# EAGLE schematic NE555_ADSR (EAGLE 7.4.0)
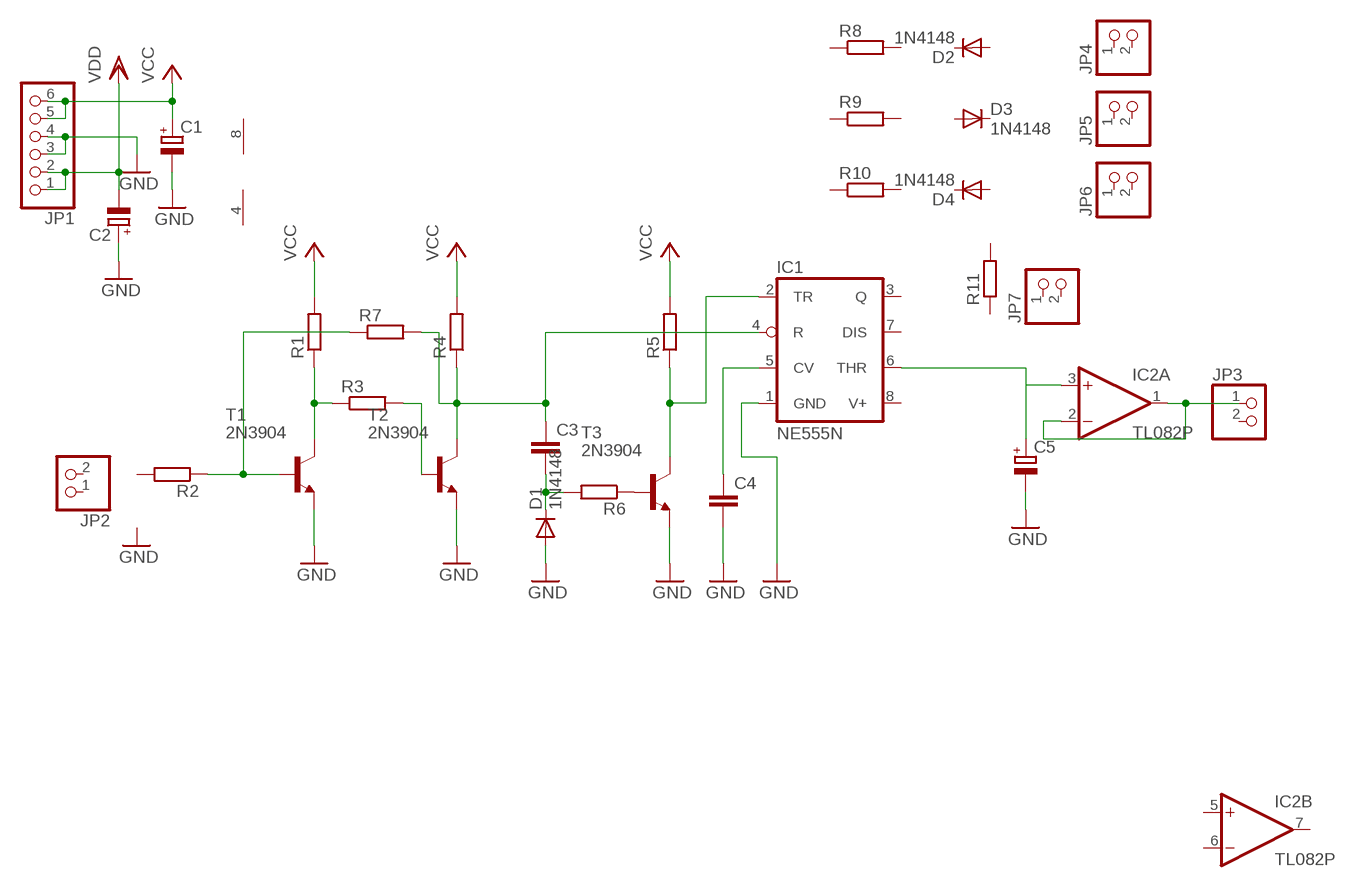
[diagram p0: schematic, sheet 1]

## Parts
C1  CPOL-EUE3.5-8  [E3,5-8]
C2  CPOL-EUE3.5-8  [E3,5-8]
C3  C7.5/3  [C7.5B3]
C4  C7.5/3  [C7.5B3]
C5  CPOL-EUE3.5-8  [E3,5-8]
D1  1N4148  1N4148DO35-7  [DO35-7]
D2  1N4148  1N4148DO35-7  [DO35-7]
D3  1N4148  1N4148DO35-7  [DO35-7]
D4  1N4148  1N4148DO35-7  [DO35-7]
IC1  NE555N  [DIL08-ROUND]
IC2  TL082P  [DIL08]
JP1  PINHD-1X6  [1X06]
JP2  PINHD-1X2  [1X02]
JP3  PINHD-1X2  [1X02]
JP4  PINHD-1X2  [1X02]
JP5  PINHD-1X2  [1X02]
JP6  PINHD-1X2  [1X02]
JP7  PINHD-1X2  [1X02]
R1  R-EU_0207/10  [0207/10]
R2  R-EU_0207/10  [0207/10]
R3  R-EU_0207/10  [0207/10]
R4  R-EU_0207/10  [0207/10]
R5  R-EU_0207/10  [0207/10]
R6  R-EU_0207/10  [0207/10]
R7  R-EU_0207/10  [0207/10]
R8  R-EU_0207/10  [0207/10]
R9  R-EU_0207/10  [0207/10]
R10  R-EU_0207/10  [0207/10]
R11  R-EU_0207/10  [0207/10]
T1  2N3904  [TO92]
T2  2N3904  [TO92]
T3  2N3904  [TO92]

## Nets
GND: C1.- C2.+ C4.2 C5.- D1.A IC1.1(GND) JP1.3 JP1.4 T1.3(E) T2.3(E) T3.3(E)
N$1: R6.1 T3.2(B)
N$4: C4.1 IC1.5(CV)
N$5: R1.1 R3.1 T1.1(C)
N$6: C3.1 IC1.4(R) R4.1 R7.2 T2.1(C)
N$7: IC1.2(TR) R5.1 T3.1(C)
N$8: R2.1 R7.1 T1.2(B)
N$9: C3.2 D1.C R6.2
N$10: R3.2 T2.2(B)
N$12: IC2.1(A:OUT) IC2.2(A:-IN) JP3.1
N$14: C5.+ IC1.6(THR) IC2.3(A:+IN)
VCC: C1.+ JP1.5 JP1.6 R1.2 R4.2 R5.2
VDD: C2.- JP1.1 JP1.2
Unconnected: D2.A D2.C D3.A D3.C D4.A D4.C IC1.3(Q) IC1.7(DIS) IC2.5(B:+IN) IC2.6(B:-IN) IC2.7(B:OUT) JP2.1 JP2.2 JP3.2 JP4.1 JP4.2 JP5.1 JP5.2 JP6.1 JP6.2 JP7.1 JP7.2 R2.2 R8.1 R8.2 R9.1 R9.2 R10.1 R10.2 R11.1 R11.2

## Power pins joined to a net without a drawn wire
V+: IC1.8(V+) IC2.8(P:V+)
V-: IC2.4(P:V-)

## Library data of the parts
C1 C2 C5 = resistor:CPOL-EU: POLARIZED CAPACITOR, European symbol
C3 C4 = capacitor-wima:C: CAPACITOR naming: grid - package width
D1-D4 = diode:1N4148: DIODE high speed (Philips)
IC1 = adafruit:*555: TIMER Changed DIP package to have round (not oval) pin pads http://www.ladyada.net/library/pcb/eaglelibrary.html
IC2 = linear:TL082: OP AMP Data sheet <http://www.ti.com/lit/ds/symlink/tl084a . pdf>; DATA_SHEET: <a href="http://www.ti.com/lit/ds/symlink/tl084a.pdf"> Data sheet </a>
JP1 = adafruit:PINHD-1X6: PIN HEADER
JP2-JP7 = pinhead:PINHD-1X2: PIN HEADER
R1-R11 = resistor:R-EU_: RESISTOR, European symbol
T1-T3 = transistor:2N3904: NPN TRANSISTOR